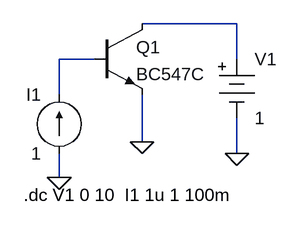
[diagram p0: schematic transistor curves.asc]
transistor curves.asc, the LTspice schematic file:
Version 4
SHEET 1 1012 680
WIRE 336 48 208 48
WIRE 144 96 96 96
WIRE 336 96 336 48
WIRE 96 144 96 96
WIRE 208 208 208 144
WIRE 336 224 336 176
WIRE 96 256 96 224
FLAG 96 256 0
FLAG 208 208 0
FLAG 336 224 0
SYMBOL current 96 224 R180
WINDOW 0 24 80 Left 2
WINDOW 3 24 0 Left 2
WINDOW 123 0 0 Left 0
WINDOW 39 0 0 Left 0
SYMATTR InstName I1
SYMATTR Value 1
SYMBOL Misc\\battery 336 80 R0
WINDOW 123 0 0 Left 0
WINDOW 39 0 0 Left 0
SYMATTR InstName V1
SYMATTR Value 1
SYMBOL npn 144 48 R0
SYMATTR InstName Q1
SYMATTR Value BC547C
TEXT 48 280 Left 2 !.dc V1 0 10  I1 1u 1 100m

The netlist it stands for:
* transistor curves.asc
I1 0 N002 1
V1 N001 0 1
Q1 N001 N002 0 0 BC547C
.model NPN NPN
.model PNP PNP
.lib standard.bjt
.dc V1 0 10  I1 1u 1 100m
.backanno
.end